# EAGLE schematic vlsibreakout (EAGLE 6.3)
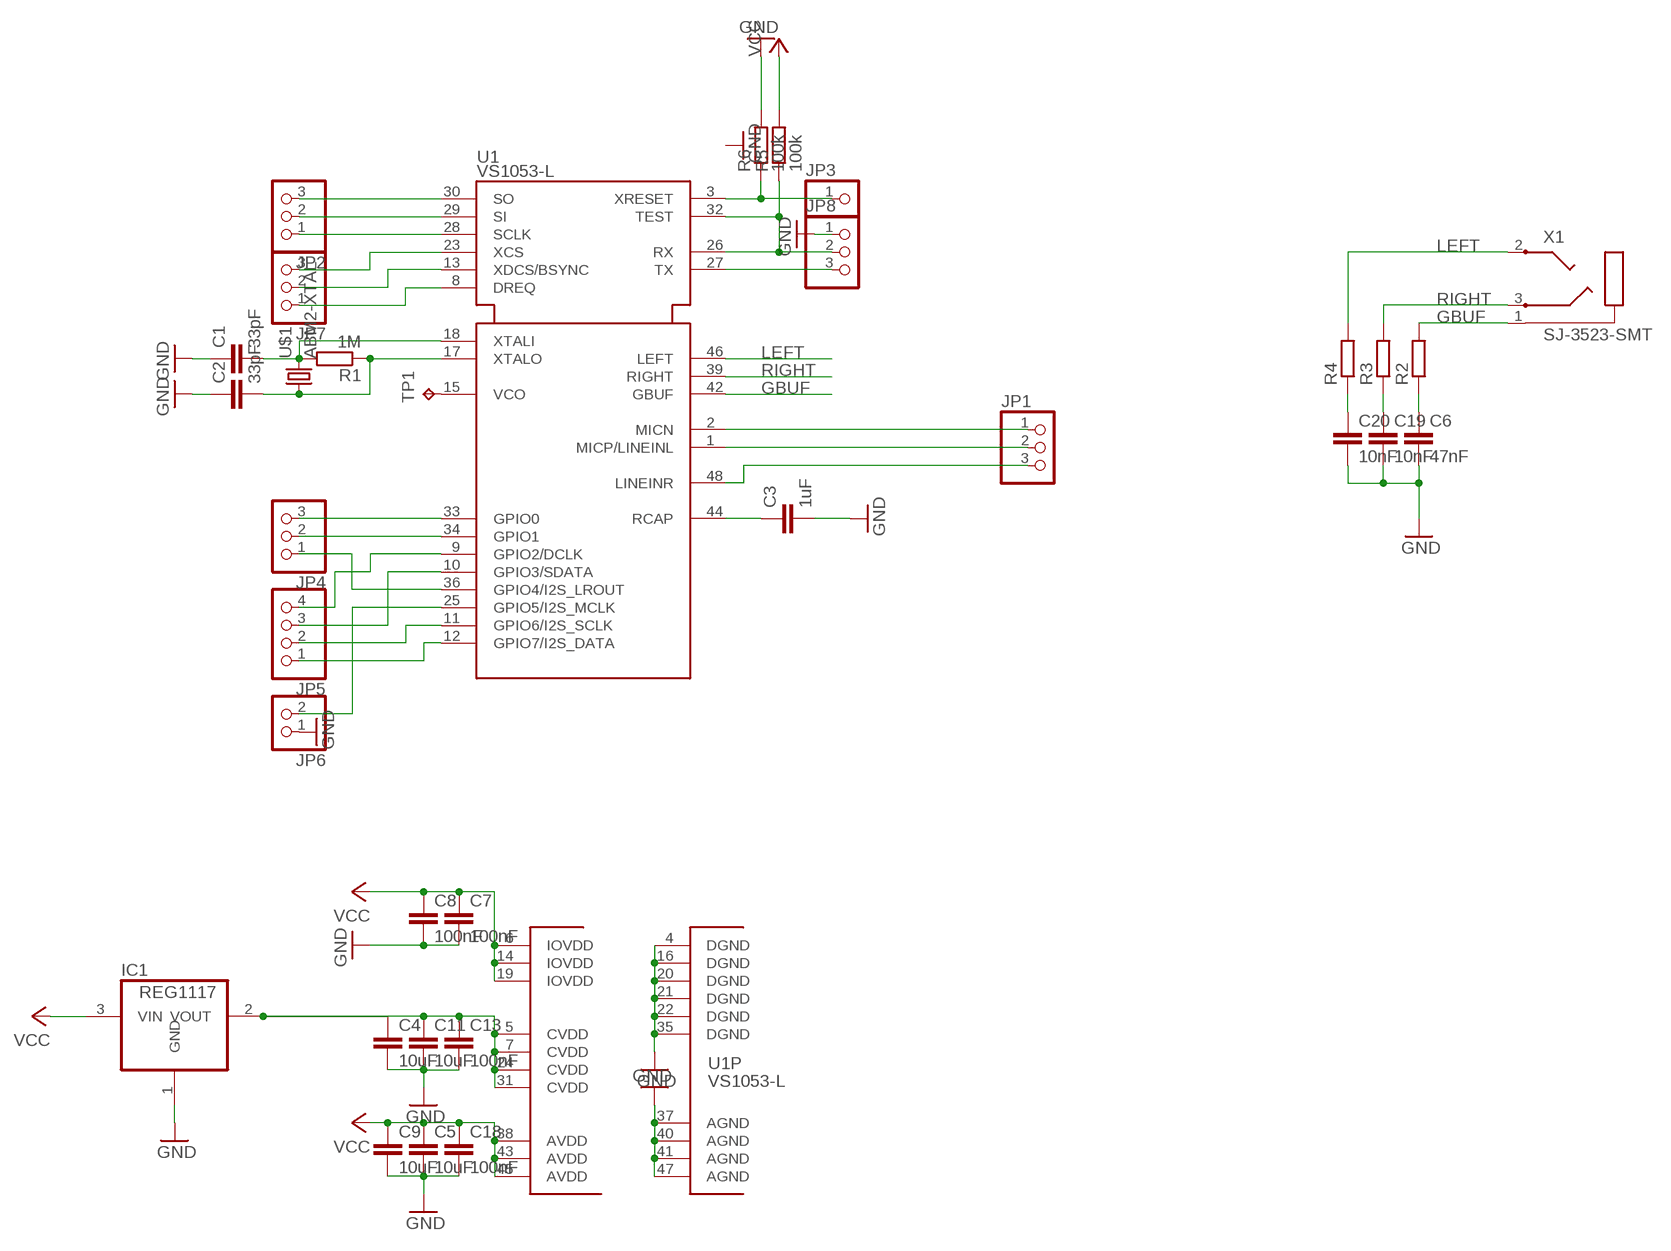
[diagram p0: schematic, sheet 1]

## Parts
C1  33pF  C-EUC0805  [C0805]
C2  33pF  C-EUC0805  [C0805]
C3  1uF  C-EUC0805  [C0805]
C4  10uF  C-EUC0805  [C0805]
C5  10uF  C-EUC0805  [C0805]
C6  47nF  C-EUC0603  [C0603]
C7  100nF  C-EUC0805  [C0805]
C8  100nF  C-EUC0805  [C0805]
C9  10uF  C-EUC0805  [C0805]
C11  10uF  C-EUC0805  [C0805]
C13  100nF  C-EUC0805  [C0805]
C18  100nF  C-EUC0805  [C0805]
C19  10nF  C-EUC0603  [C0603]
C20  10nF  C-EUC0603  [C0603]
IC1  REG1117  [SOT223]
JP1  PINHD-1X3  [1X03]
JP2  PINHD-1X3  [1X03]
JP3  PINHD-1X1  [1X01]
JP4  PINHD-1X3  [1X03]
JP5  PINHD-1X4  [1X04]
JP6  PINHD-1X2  [1X02]
JP7  PINHD-1X3  [1X03]
JP8  PINHD-1X3  [1X03]
R1  1M  R-EU_R0805  [R0805]
R2  R-EU_R0603  [R0603]
R3  R-EU_R0603  [R0603]
R4  R-EU_R0603  [R0603]
R5  100k  R-EU_R0603  [R0603]
R6  100k  R-EU_R0603  [R0603]
TP1  TPB1,27  [B1,27]
U1  VS1053-L  [LQFP48]
U$1  ABM2-XTAL  [ABM2]
X1  SJ-3523-SMT  [SJ-3523-SMT]

## Nets
GBUF: R2.2 U1.42(GBUF) X1.1(EARTH)
GND: C1.1 C2.1 C3.2 C4.2 C5.2 C6.2 C7.2 C8.2 C9.2 C11.2 C13.2 C18.2 C19.2 C20.2 IC1.1(GND) JP6.1 JP8.1 R6.2 U1.4(DGND) U1.16(DGND) U1.20(DGND) U1.21(DGND) U1.22(DGND) U1.35(DGND) U1.37(AGND) U1.40(AGND) U1.41(AGND) U1.47(AGND)
LEFT: R4.2 U1.46(LEFT) X1.2(TIP)
N$1: C3.1 U1.44(RCAP)
N$2: C2.2 R1.1 U1.17(XTALO) U$1.P$1
N$3: C1.2 R1.2 U1.18(XTALI) U$1.P$2
N$4: C6.1 R2.1
N$5: C19.1 R3.1
N$6: C20.1 R4.1
N$7: JP1.1 U1.2(MICN)
N$8: JP1.2 U1.1(MICP/LINEINL)
N$9: JP1.3 U1.48(LINEINR)
N$10: JP2.1 U1.28(SCLK)
N$11: JP2.2 U1.29(SI)
N$12: JP2.3 U1.30(SO)
N$13: JP8.2 R5.1 U1.26(RX) U1.32(TEST)
N$14: JP8.3 U1.27(TX)
N$15: JP3.1 R6.1 U1.3(XRESET)
N$16: JP4.3 U1.33(GPIO0)
N$17: JP4.2 U1.34(GPIO1)
N$18: JP4.1 U1.36(GPIO4/I2S_LROUT)
N$19: JP5.4 U1.9(GPIO2/DCLK)
N$20: JP5.3 U1.10(GPIO3/SDATA)
N$21: JP5.2 U1.11(GPIO6/I2S_SCLK)
N$22: JP5.1 U1.12(GPIO7/I2S_DATA)
N$23: JP6.2 U1.25(GPIO5/I2S_MCLK)
N$24: JP7.1 U1.8(DREQ)
N$25: JP7.2 U1.13(XDCS/BSYNC)
N$26: JP7.3 U1.23(XCS)
N$27: TP1.TP U1.15(VCO)
N$28: C4.1 C11.1 C13.1 IC1.2(VOUT) U1.5(CVDD) U1.7(CVDD) U1.24(CVDD) U1.31(CVDD)
RIGHT: R3.2 U1.39(RIGHT) X1.3(RING)
VCC: C5.1 C7.1 C8.1 C9.1 C18.1 IC1.3(VIN) R5.2 U1.6(IOVDD) U1.14(IOVDD) U1.19(IOVDD) U1.38(AVDD) U1.43(AVDD) U1.45(AVDD)

## Library data of the parts
C1-C3 C6 C19 C20 = rcl:C-EU: CAPACITOR, European symbol
C4 C5 C7-C9 C11 C13 C18 = resistor:C-EU: CAPACITOR, European symbol
IC1 = burr-brown:REG1117: 800mA and 1A Low Dropout (LDO) Positive Regulator 1.8V, 2.5V, 2.85V, 3.3V, 5V, and Adj; MPN: REG1117; OC_FARNELL: 1097566; OC_NEWARK: 14P6981
JP1 JP2 JP4 JP7 JP8 = pinhead:PINHD-1X3: PIN HEADER
JP3 = pinhead:PINHD-1X1: PIN HEADER
JP5 = pinhead:PINHD-1X4: PIN HEADER
JP6 = pinhead:PINHD-1X2: PIN HEADER
R1 R5 R6 = rcl:R-EU_: RESISTOR, European symbol
R2-R4 = resistor:R-EU_: RESISTOR, European symbol
TP1 = testpad:TP: Test pad
U1 = vlsi:VS1053
U$1 = armin:ABM2-XTAL
X1 = con-cuistack:SJ-3523: 3.5 Stereo audio jack (SMT)